# Altium schematic sheet CPU-board-Sheet3-multi-rev.0.1.SchDoc
size A3; SheetNumber: 3
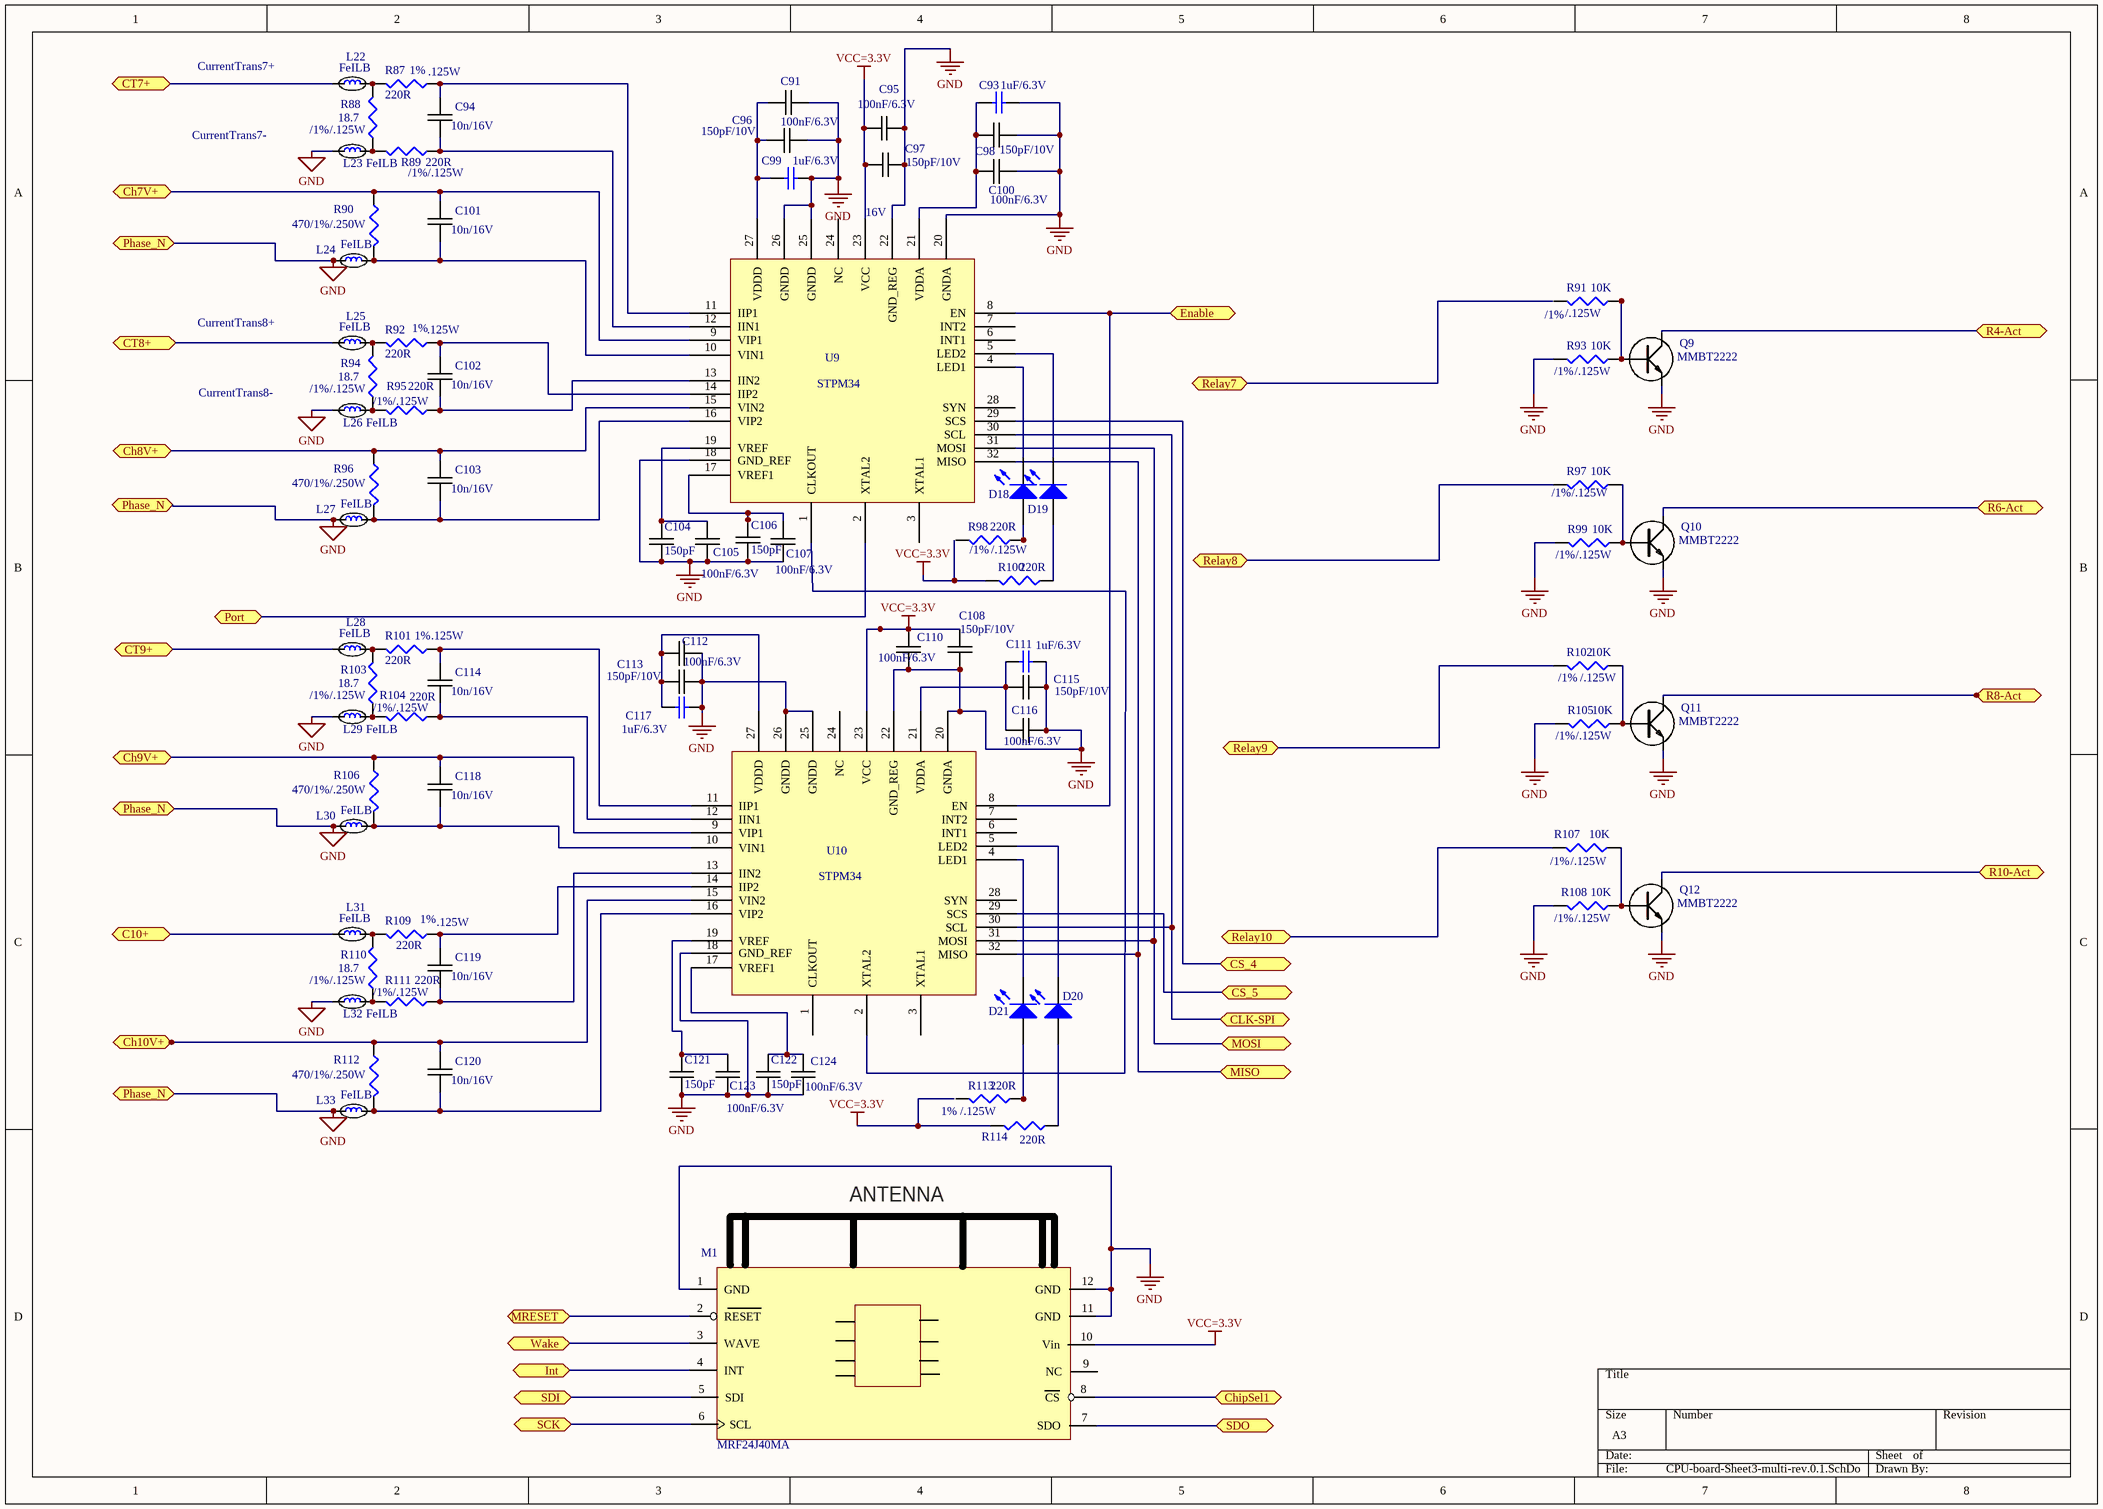
[diagram p0: CPU-board-Sheet3-multi-rev.0.1.SchDoc]

## Parts
C91  100nF/6.3V  [0402C-GENERIC]
C93  1uF/6.3V  [0402C-GENERIC]
C94  10n/16V  [0402C-GENERIC]
C95  100nF/6.3V  [0402C-GENERIC]
C96  150pF/10V  [0402C-GENERIC]
C97  150pF/10V  [0402C-GENERIC]
C98  150pF/10V  [0402C-GENERIC]
C99  1uF/6.3V  [0402C-GENERIC]
C100  100nF/6.3V  [0402C-GENERIC]
C101  10n/16V  [0402C-GENERIC]
C102  10n/16V  [0402C-GENERIC]
C103  10n/16V  [0402C-GENERIC]
C104  150pF  [0402C-GENERIC]
C105  100nF/6.3V  [0402C-GENERIC]
C106  150pF  [0402C-GENERIC]
C107  100nF/6.3V  [0402C-GENERIC]
C108  150pF/10V  [0402C-GENERIC]
C110  100nF/6.3V  [0402C-GENERIC]
C111  1uF/6.3V  [0402C-GENERIC]
C112  100nF/6.3V  [0402C-GENERIC]
C113  150pF/10V  [0402C-GENERIC]
C114  10n/16V  [0402C-GENERIC]
C115  150pF/10V  [0402C-GENERIC]
C116  100nF/6.3V  [0402C-GENERIC]
C117  1uF/6.3V  [0402C-GENERIC]
C118  10n/16V  [0402C-GENERIC]
C119  10n/16V  [0402C-GENERIC]
C120  10n/16V  [0402C-GENERIC]
C121  150pF  [0402C-GENERIC]
C122  150pF  [0402C-GENERIC]
C123  100nF/6.3V  [0402C-GENERIC]
C124  100nF/6.3V  [0402C-GENERIC]
D18  LED2  [LED-SM]  (value not drawn)
D19  LED2  [LED-SM]  (value not drawn)
D20  LED2  [LED-SM]  (value not drawn)
D21  LED2  [LED-SM]  (value not drawn)
L22  FeILB  [0603C-TBD]
L23  FeILB  [0603C-TBD]
L24  FeILB  [0603C-TBD]
L25  FeILB  [0603C-TBD]
L26  FeILB  [0603C-TBD]
L27  FeILB  [0603C-TBD]
L28  FeILB  [0603C-TBD]
L29  FeILB  [0603C-TBD]
L30  FeILB  [0603C-TBD]
L31  FeILB  [0603C-TBD]
L32  FeILB  [0603C-TBD]
L33  FeILB  [0603C-TBD]
M1  MRF24J40MA  [MRF24J40MA-zigBEE module]
Q9  MMBT2222  [MMBT2222]
Q10  MMBT2222  [MMBT2222]
Q11  MMBT2222  [MMBT2222]
Q12  MMBT2222  [MMBT2222]
R87  220R  [0402R-TBD]
R88  18.7  [0402R-TBD]
R89  220R  [0402R-TBD]
R90  470/1%/.250W  [1206FB-GENERIC]
R91  10K  [0402R-TBD]
R92  220R  [0402R-TBD]
R93  10K  [0402R-TBD]
R94  18.7  [0402R-TBD]
R95  220R  [0402R-TBD]
R96  470/1%/.250W  [1206FB-GENERIC]
R97  10K  [0402R-TBD]
R98  220R  [0402R-TBD]
R99  10K  [0402R-TBD]
R100  220R  [0402R-TBD]
R101  220R  [0402R-TBD]
R102  10K  [0402R-TBD]
R103  18.7  [0402R-TBD]
R104  220R  [0402R-TBD]
R105  10K  [0402R-TBD]
R106  470/1%/.250W  [1206FB-GENERIC]
R107  10K  [0402R-TBD]
R108  10K  [0402R-TBD]
R109  220R  [0402R-TBD]
R110  18.7  [0402R-TBD]
R111  220R  [0402R-TBD]
R112  470/1%/.250W  [1206FB-GENERIC]
R113  220R  [0402R-TBD]
R114  220R  [0402R-TBD]
U9  STPM34  [QFN32_L]
U10  STPM34  [QFN32_L]

## Ports
C10+, Ch7V+, Ch8V+, Ch9V+, Ch10V+, ChipSel1, CLK-SPI, CS_4, CS_5, CT7+, CT8+, CT9+, Enable, Int, MISO, MOSI, MRESET, Phase_N, Port, R4-Act, R6-Act, R8-Act, R10-Act, Relay7, Relay8, Relay9, Relay10, SCK, SDI, SDO, Wake

## Nets
GND: C91.2 C93.2 C95.2 C96.2 C97.2 C98.1 C99.2 C100.2 C104.2 C105.2 C106.2 C107.2 C108.2 C110.1 C111.2 C112.2 C113.2 C115.2 C116.2 C117.2 C121.2 C122.2 C123.2 C124.2 L23.1 L24.1 L26.1 L27.1 L29.1 L30.1 L32.1 L33.1 M1.1(GND) M1.11(GND) M1.12(GND) Q9.E Q10.E Q11.E Q12.E R93.2 R99.2 R105.2 R108.2 U9.18(GND_REF) U9.20(GNDA) U9.22(GND_REG) U9.25(GNDD) U9.26(GNDD) U10.18(GND_REF) U10.20(GNDA) U10.22(GND_REG) U10.25(GNDD) U10.26(GNDD) ; port Phase_N
VCC=3.3V: C95.1 C97.1 C108.1 C110.2 M1.10(Vin) R100.2 R114.2 U9.23(VCC) U10.23(VCC)
C10+: L31.1 ; port C10+
Ch7V+: C101.2 R90.1 U9.9(VIP1) ; port Ch7V+
Ch8V+: C103.2 R96.1 U9.15(VIN2) ; port Ch8V+
Ch9V+: C118.2 R106.1 U10.9(VIP1) ; port Ch9V+
Ch10V+: C120.2 R112.1 U10.15(VIN2) ; port Ch10V+
ChipSel1: M1.8(CS) ; port ChipSel1
CLK-SPI: U9.30(SCL) U10.30(SCL) ; port CLK-SPI
CS_4: U9.29(SCS) ; port CS_4
CS_5: U10.29(SCS) ; port CS_5
CT7+: L22.1 ; port CT7+
CT8+: L25.1 ; port CT8+
CT9+: L28.1 ; port CT9+
Enable: U9.8(EN) U10.8(EN) ; port Enable
Int: M1.4(INT) ; port Int
MISO: U9.32(MISO) U10.32(MISO) ; port MISO
MOSI: U9.31(MOSI) U10.31(MOSI) ; port MOSI
MRESET: M1.2(RESET) ; port MRESET
Port: U9.2(XTAL2) ; port Port
R4-Act: Q9.C ; port R4-Act
R6-Act: Q10.C ; port R6-Act
R8-Act: Q11.C ; port R8-Act
R10-Act: Q12.C ; port R10-Act
Relay8: R97.2 ; port Relay8
Relay9: R102.2 ; port Relay9
Relay10: R107.2 ; port Relay10
SCK: M1.6(SCL) ; port SCK
SDI: M1.5(SDI) ; port SDI
SDO: M1.7(SDO) ; port SDO
Wake: M1.3(WAVE) ; port Wake
NetC91_1: C91.1 C96.1 C99.1 U9.27(VDDD)
NetC93_1: C93.1 C98.2 C100.1 U9.21(VDDA)
NetC94_1: C94.1 R89.1 U9.12(IIN1)
NetC94_2: C94.2 R87.1 U9.11(IIP1)
NetC101_1: C101.1 L24.2 R90.2 U9.10(VIN1)
NetC102_1: C102.1 R95.1 U9.13(IIN2)
NetC102_2: C102.2 R92.1 U9.14(IIP2)
NetC103_1: C103.1 L27.2 R96.2 U9.16(VIP2)
NetC104_1: C104.1 C105.1 U9.19(VREF)
NetC106_1: C106.1 C107.1 U9.17(VREF1)
NetC111_1: C111.1 C115.1 C116.1 U10.21(VDDA)
NetC112_1: C112.1 C113.1 C117.1 U10.27(VDDD)
NetC114_1: C114.1 R104.1 U10.12(IIN1)
NetC114_2: C114.2 R101.1 U10.11(IIP1)
NetC118_1: C118.1 L30.2 R106.2 U10.10(VIN1)
NetC119_1: C119.1 R111.1 U10.13(IIN2)
NetC119_2: C119.2 R109.1 U10.14(IIP2)
NetC120_1: C120.1 L33.2 R112.2 U10.16(VIP2)
NetC121_1: C121.1 C123.1 U10.19(VREF)
NetC122_1: C122.1 C124.1 U10.17(VREF1)
NetD18_1: D18.1(A) R98.1
NetD18_2: D18.2(K) U9.4(LED1)
NetD19_1: D19.1(A) R100.1
NetD19_2: D19.2(K) U9.5(LED2)
NetD20_1: D20.1(A) R114.1
NetD20_2: D20.2(K) U10.5(LED2)
NetD21_1: D21.1(A) R113.1
NetD21_2: D21.2(K) U10.4(LED1)
NetL22_2: L22.2 R87.2 R88.2
NetL23_2: L23.2 R88.1 R89.2
NetL25_2: L25.2 R92.2 R94.2
NetL26_2: L26.2 R94.1 R95.2
NetL28_2: L28.2 R101.2 R103.2
NetL29_2: L29.2 R103.1 R104.2
NetL31_2: L31.2 R109.2 R110.2
NetL32_2: L32.2 R110.1 R111.2
NetQ9_B: Q9.B R91.1 R93.1
NetQ10_B: Q10.B R97.1 R99.1
NetQ11_B: Q11.B R102.1 R105.1
NetQ12_B: Q12.B R107.1 R108.1
NetU9_1: U9.1(CLKOUT) U10.2(XTAL2)

Not connected (* = marked no-connect by the designer): M1 9(NC); R91 2; R98 2; R113 2; U9 3(XTAL1) 6(INT1) 7(INT2) 24(NC) 28(SYN); U10 1(CLKOUT) 3(XTAL1) 6(INT1) 7(INT2) 24(NC) 28(SYN)

## Notes on the sheet
- CurrentTrans7+
- (near R87) 1%
- (near R87) .125W
- CurrentTrans7-
- (near L23) /1%
- /.125W
- (near R89) /1%/.125W
- 16V
- (near R91) /1%
- (near R91) /.125W
- CurrentTrans8+
- (near R92) 1%
- (near R92) .125W
- (near R93) /1%
- (near R93) /.125W
- CurrentTrans8-
- (near L26) /1%
- /1%/.125W
- (near R97) /1%
- (near R97) /.125W
- (near R98) /1%
- (near R98) /.125W
- (near R99) /1%
- (near R99) /.125W
- (near R101) 1%
- (near R101) .125W
- (near L29) /1%
- (near R102) /1%
- (near R102) /.125W
- (near R105) /1%
- (near R105) /.125W
- (near R109) 1%
- (near R107) /1%
- (near R108) /1%
- (near R107) /.125W
- (near R108) /.125W
- (near L32) /1%
- (near R109) .125W
- (near R113) 1%
- (in symbol MRF24J40MA) ANTENNA

## Library data of the parts
C91 C95 C100 C105 C107 C110 C112 C116 C123 C124 = 0805C-18PF-50V-C0G-JOH: CAPACITOR 0805 CERAMIC; mfr PN: LMK105BJ104KV-F; Manufacturer: Taiyo Yuden; Mfr.PN#: CRM155R71H103KA880; Value: 100nF/16V; Suppl.PN#: 587-1227-1-ND; Supplier 1: Digi-Key; Supplier Part Number 1: 709-1171-2-ND; Package reference: 0805-TBD; Supplier: Digi-Key; PackageReference: 0402; Price: .002
C93 C99 C111 C117 = Cap: Capacitor; Manufacturer: Murata; Mfr.PN#: GRM155R60J105KE19D; Value: 1uF; Suppl.PN#: 490-1320-1-ND; Published: 8-Jun-2000; LatestRevisionDate: 17-Jul-2002; LatestRevisionNote: Re-released for DXP Platform.; PackageReference: 0402; Publisher: Altium Limited; PackageDescription: Radial Cap, Thru-Hole; 2 Leads; 0.3 in Pin Spacing; Supplier: DigiKey
C94 C101-C103 C114 C118-C120 = 0805C-18PF-50V-C0G-JOH: CAPACITOR 0805 CERAMIC; Manufacturer: Murata Electronics; Mfr.PN#: GRM155R71C103KA01D; Value: 10n; Suppl.PN#: 490-1313-1-ND; Supplier 1: Digi-Key; Supplier Part Number 1: 709-1171-2-ND; mfr PN: *; PackageReference: 0402; Supplier: Digi-Key; Suppl.PN#: GRM155R71C103KA01D; smd: 0402; Price: .002
C96-C98 C108 C113 C115 = 0805C-18PF-50V-C0G-JOH: CAPACITOR 0805 CERAMIC; Manufacturer: Wurth Electronics; Mfr.PN#: 885012005014; Suppl.PN#: 732-7432-1-ND; Supplier 1: Digi-Key; Supplier Part Number 1: 709-1171-2-ND; Value: 150pF/10V; mfr PN: *; Supplier: Digi-Key; Price: .002
  C96 C113 C115: Package reference: 0805-TBD; PackageReference: 0402
  C97 C98: PackageReference: 0402; smd: 0402
  C108: Package reference: 0805-TBD; smd: 0402
C104 C106 C121 C122 = 0805C-18PF-50V-C0G-JOH: CAPACITOR 0805 CERAMIC; Manufacturer: Wurth Electronics; Mfr.PN#: 885012005014; Value: 150pF/10V; Suppl.PN#: 732-7432-1-ND; Supplier 1: Digi-Key; Supplier Part Number 1: 709-1171-2-ND; mfr PN: *; PackageReference: 0402; Supplier: Digi-Key; smd: 0402; Price: .002
D18-D21 = LED2: Typical RED, GREEN, YELLOW, AMBER GaAs LED; Manufacturer: Lite-On Inc; Mfr.PN#: LTST-C191KGKT; Suppl.PN#: 160-1446-2-ND; Published: 8-Jun-2000; LatestRevisionDate: 17-Jul-2002; LatestRevisionNote: Re-released for DXP Platform.; PackageVersion: Feb-2002; PackageReference: 0603; Publisher: Altium Limited; PackageDescription: SM LED; 2 Flat Leads; Supplier: Digi-Key; Price: .04
L22-L33 = FerrBeads/ILBB: Manufacturer: Brand Samsung; Mfr.PN#: C1M10J152NC; Suppl.PN#: 1276-6326-1-ND; Supplier: Digi-Key; Price: .027
M1 = MRF24J40MA: Manufacturer: Microchip; Mfr.PN#: MRF24J40MDT-I/RM; Suppl.PN#: MRF24J40MDT-I/RMCT-ND; Supplier: Digi-Key; Price: 6.08
Q9-Q12 = MMBT2222: BC847 SMALL SIGNAL NPN TRANSISTOR; Manufacturer: Diodes  Inc.; Mfr.PN#: MMBT2222A-7-F; Suppl.PN#: MMBT2222A-FDICT-ND; Supplier 1: Digi-Key; Supplier Part Number 1: MMBT2222A-FDICT-ND; Supplier: Digi-Key; PackageReference: SOT23-3; Price: .03
R87 R89 R92 R95 R98 R100 R101 R104 R109 R111 R113 R114 = Res3: Resistor; Manufacturer: Panasonic; Mfr.PN#: ERJ-2RKF1001X; Value: 1K; Suppl.PN#: P1.00KLCT-ND; Published: 8-Jun-2000; LatestRevisionDate: 29-May-2009; LatestRevisionNote: IPC-7351 Footprint Added.; PackageReference: 0402; Publisher: Altium Limited; PackageDescription: Chip Resistor; Supplier: DigiKey; Price: .0035
R88 R94 R103 R110 = Res3: Resistor; Manufacturer: Panasonic; Mfr.PN#: ERJ-2RKF18R7X; Value: 18.7 1%; Suppl.PN#: P18.7LCT-ND; Published: 8-Jun-2000; LatestRevisionDate: 29-May-2009; LatestRevisionNote: IPC-7351 Footprint Added.; PackageReference: 0402; Publisher: Altium Limited; PackageDescription: Chip Resistor; Supplier: Digi-Key; Price: .05; SMD: 0805
R90 R96 R106 R112 = Res3: Resistor; Manufacturer: Panasonic Co; Mfr.PN#: ERJ-P06F6650V; Value: 470 1%/.250W; Suppl.PN#: RMCF1206FT470RDKR-ND; Published: 8-Jun-2000; LatestRevisionDate: 29-May-2009; LatestRevisionNote: IPC-7351 Footprint Added.; PackageReference: 1206; Publisher: Altium Limited; PackageDescription: Chip Resistor; Supplier: Digi-Key; SMD: 1206; Price: .02
R91 R93 R97 R99 R102 R105 R107 R108 = Res3: Resistor; Manufacturer: Panasonic; Mfr.PN#: ERJ-2RKF1002X; Value: 100K; Suppl.PN#: P10.0KLTR-ND; Published: 8-Jun-2000; LatestRevisionDate: 29-May-2009; LatestRevisionNote: IPC-7351 Footprint Added.; PackageReference: 0402; Publisher: Altium Limited; PackageDescription: Chip Resistor; Supplier: Digi-Key; Price: .0035